# EasyEDA schematic 原理图_转接板2_不含压缩推杆控制.json
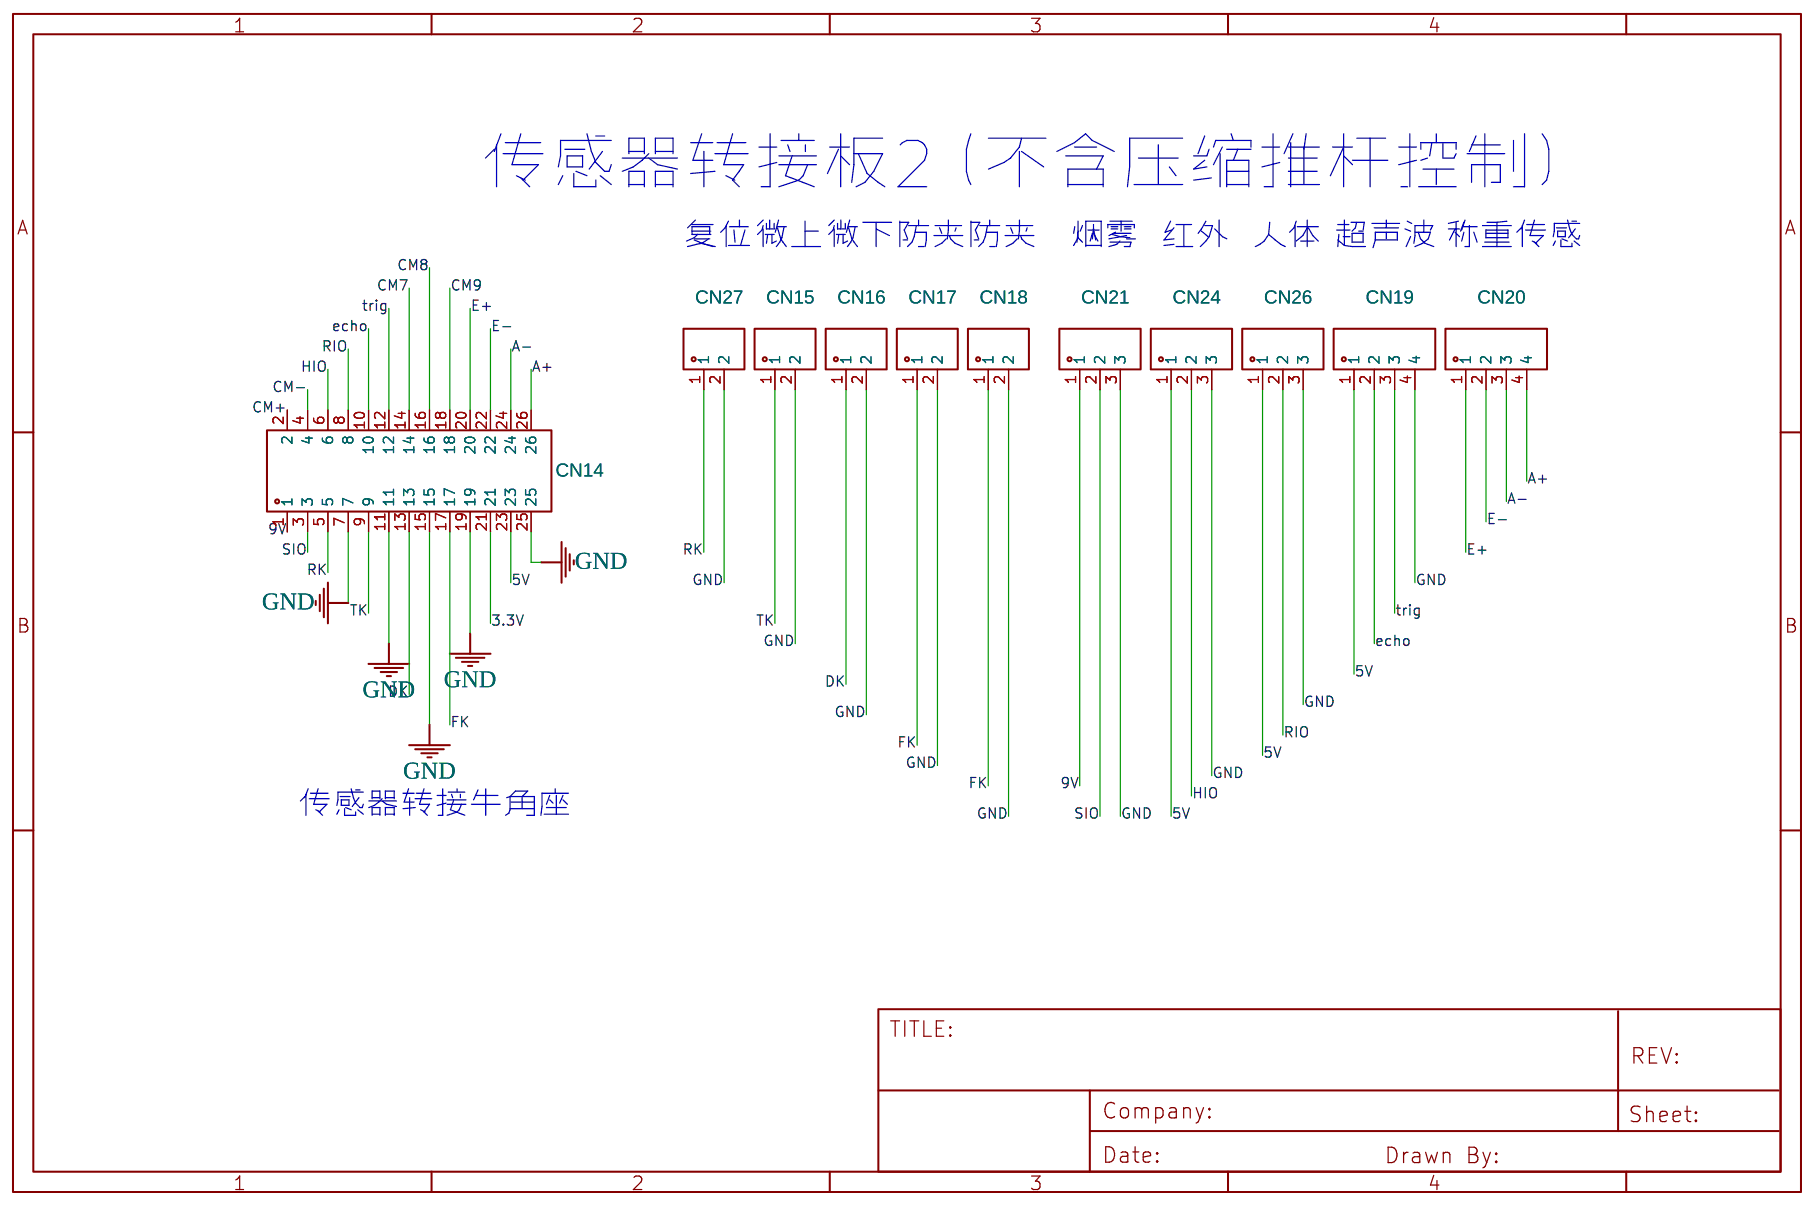
[diagram p0: schematic sheet]

## Parts
CN14  Shenzhen  [CONN-TH_26P-P2.54_B-3000S26P-0110]
CN15  KF2EDGR-2.54-2P  [CONN-TH_P2.54_KF2EDGR-2.54-2P]
CN16  KF2EDGR-2.54-2P  [CONN-TH_P2.54_KF2EDGR-2.54-2P]
CN17  KF2EDGR-2.54-2P  [CONN-TH_P2.54_KF2EDGR-2.54-2P]
CN18  KF2EDGR-2.54-2P  [CONN-TH_P2.54_KF2EDGR-2.54-2P]
CN19  KF2EDGR-2.54-4P  [CONN-TH_4P-P2.54_KF2EDGR-2.54-4P]
CN20  KF2EDGR-2.54-4P  [CONN-TH_4P-P2.54_KF2EDGR-2.54-4P]
CN21  KF2EDGR-2.54-3P  [CONN-TH_3P-P2.54_KF2EDGR-2.54-3P]
CN24  KF2EDGR-2.54-3P  [CONN-TH_3P-P2.54_KF2EDGR-2.54-3P]
CN26  KF2EDGR-2.54-3P  [CONN-TH_3P-P2.54_KF2EDGR-2.54-3P]
CN27  KF2EDGR-2.54-2P  [CONN-TH_P2.54_KF2EDGR-2.54-2P]

## Library data of the parts
CN14 = B-3000S26P-0110: Supplier: LCSC; Supplier Part: C383600; Manufacturer: Shenzhen Cankemeng; Contributor: LCSC
CN15-CN18 CN27 = KF2EDGR-2.54-2P: Supplier: LCSC; Supplier Part: C577594; Manufacturer: Cixi Kefa Elec; Contributor: LCSC; JLCPCB SMD: Yes; SMT Type: Extend; Paste Type: expand; Assembly Type: manualWeld
CN19 CN20 = KF2EDGR-2.54-4P: Supplier: LCSC; Supplier Part: C577596; Manufacturer: Cixi Kefa Elec; Contributor: LCSC; JLCPCB SMD: Yes; SMT Type: Extend; Paste Type: expand; Assembly Type: manualWeld
CN21 CN24 CN26 = KF2EDGR-2.54-3P: Supplier: LCSC; Supplier Part: C577595; Manufacturer: Cixi Kefa Elec; Contributor: LCSC; JLCPCB SMD: Yes; SMT Type: Extend; Paste Type: expand; Assembly Type: manualWeld

## Nets
3.3V: CN14.21
5V: CN14.23 CN19.1 CN24.1 CN26.1
9V: CN14.1 CN21.1
GND: CN14.7 CN14.11 CN14.15 CN14.19 CN14.25 CN15.2 CN16.2 CN17.2 CN18.2 CN19.4 CN21.3 CN24.3 CN26.3 CN27.2
A+: CN14.26 CN20.4
A-: CN14.24 CN20.3
CM7: CN14.14
CM8: CN14.16
CM9: CN14.18
CM+: CN14.2
CM-: CN14.4
DK: CN14.13 CN16.1
E+: CN14.20 CN20.1
E-: CN14.22 CN20.2
echo: CN14.10 CN19.2
FK: CN14.17 CN17.1 CN18.1
HIO: CN14.6 CN24.2
RIO: CN14.8 CN26.2
RK: CN14.5 CN27.1
SIO: CN14.3 CN21.2
TK: CN14.9 CN15.1
trig: CN14.12 CN19.3

## Notes on the sheet
- 传感器转接板2（不含压缩推杆控制）
- 复位
- 微上
- 微下
- 防夹
- 防夹
- 烟雾
- 红外
- 人体
- 超声波
- 称重传感
- 传感器转接牛角座
